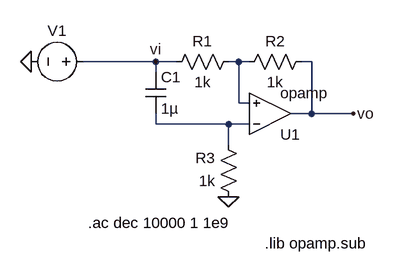
[diagram p0: schematic apf_sim.asc]
apf_sim.asc, the LTspice schematic file:
Version 4
SHEET 1 880 680
WIRE 192 240 80 240
WIRE 224 240 192 240
WIRE 320 240 304 240
WIRE 336 240 320 240
WIRE 432 240 416 240
WIRE 192 256 192 240
WIRE 320 304 320 240
WIRE 336 304 320 304
WIRE 432 320 432 240
WIRE 432 320 400 320
WIRE 496 320 432 320
WIRE 192 336 192 320
WIRE 304 336 192 336
WIRE 336 336 304 336
WIRE 304 368 304 336
FLAG 304 448 0
FLAG 0 240 0
FLAG 192 240 vi
FLAG 496 320 vo
SYMBOL res 320 224 R90
WINDOW 0 0 56 VBottom 2
WINDOW 3 32 56 VTop 2
SYMATTR InstName R1
SYMATTR Value 1k
SYMBOL res 432 224 R90
WINDOW 0 0 56 VBottom 2
WINDOW 3 32 56 VTop 2
SYMATTR InstName R2
SYMATTR Value 1k
SYMBOL res 320 464 R180
WINDOW 0 36 76 Left 2
WINDOW 3 36 40 Left 2
SYMATTR InstName R3
SYMATTR Value 1k
SYMBOL cap 176 256 R0
SYMATTR InstName C1
SYMATTR Value 1µ
SYMBOL voltage 96 240 R90
WINDOW 0 -32 56 VBottom 2
WINDOW 3 32 56 VTop 2
SYMATTR InstName V1
SYMATTR Value ""
SYMATTR Value2 AC .1
SYMBOL opamp 368 384 M180
SYMATTR InstName U1
SYMATTR SpiceLine2 GBW=1000T
TEXT 88 488 Left 2 !.ac dec 10000 1 1e9
TEXT 360 520 Left 2 !.lib opamp.sub

The netlist it stands for:
* apf_sim.asc
R1 N001 vi 1k
R2 vo N001 1k
R3 0 N002 1k
C1 vi N002 1µ
V1 vi 0 AC .1
XU1 N002 N001 vo opamp Aol=100K GBW=1000T  ; pins invin noninvin out
.ac dec 10000 1 1e9
.lib opamp.sub
.backanno
.end